# Altium schematic sheet E-25 Microphone.SchDoc: E-25 Microphone
size B; DrawnBy: Jeremie Boulianne; Organization: Synthiam Inc.; Address1: Unit 10, 6120 - 11 St. SE; Address2: Calgary, AB; Address3: T2H 2L7; Address4: Canada; Revision: 0
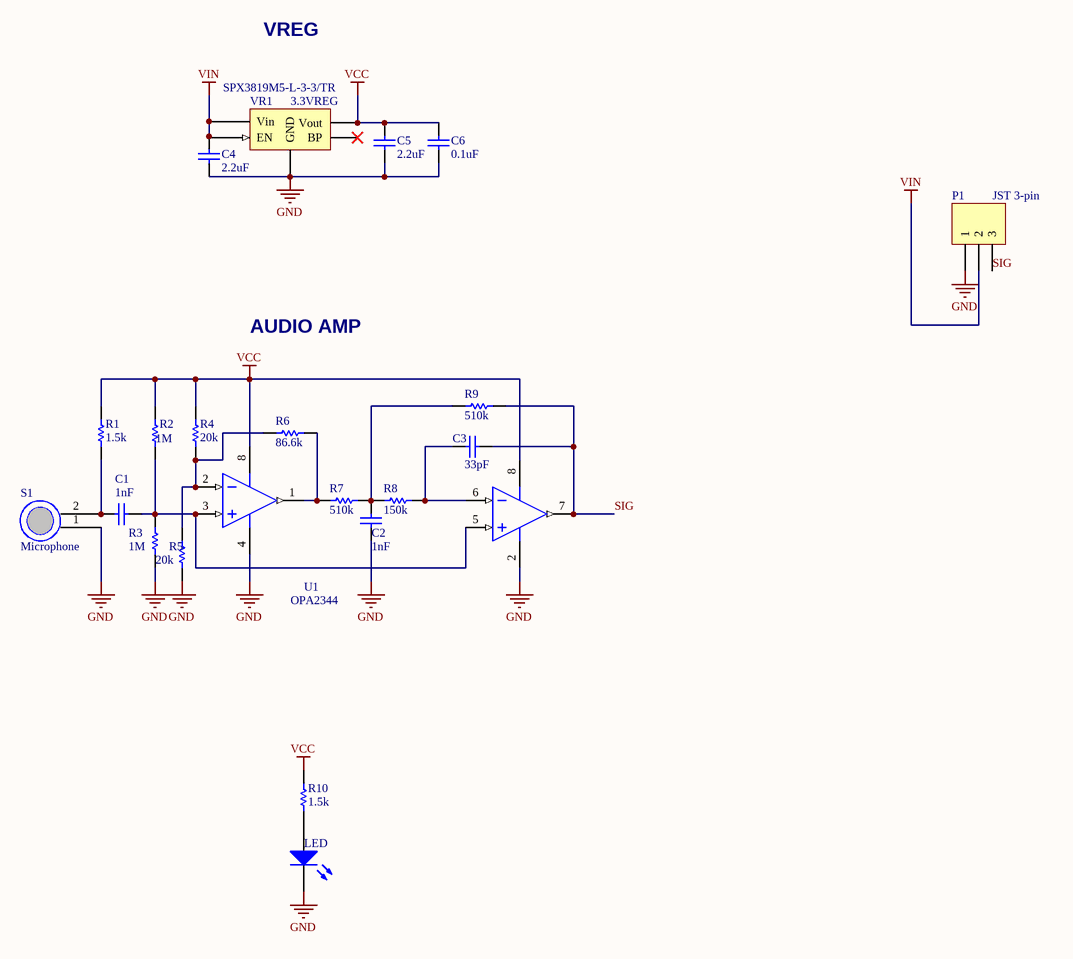
[diagram p0: E-25 Microphone.SchDoc]

## Parts
C1  value 1nF  [0603 TIGHT]  (hidden comment: 18pF)
C2  1nF  [0603 TIGHT]
C3  value 33pF  [0603 TIGHT]  (hidden comment: 18pF)
C4  2.2uF  [0603 TIGHT]
C5  value 2.2uF  [0603 TIGHT]  (hidden comment: 100nF)
C6  value 0.1uF  [0603 TIGHT]  (hidden comment: 100nF)
LED  LED2  [0805 LED - TIGHT]  (value not drawn)
P1  JST 3-pin  [JST-PH 3-pin SMD]
R1  value 1.5k  [0603 TIGHT]  (hidden comment: Res1)
R2  value 1M  [0603 TIGHT]  (hidden comment: Res1)
R3  value 1M  [0603 TIGHT]  (hidden comment: Res1)
R4  value 20k  [0603 TIGHT]  (hidden comment: Res1)
R5  value 20k  [0603 TIGHT]  (hidden comment: Res1)
R6  value 86.6k  [0603 TIGHT]  (hidden comment: Res1)
R7  value 510k  [0603 TIGHT]  (hidden comment: Res1)
R8  value 150k  [0603 TIGHT]  (hidden comment: Res1)
R9  value 510k  [0603 TIGHT]  (hidden comment: Res1)
R10  value 1.5k  [0603 TIGHT]  (hidden comment: Res1)
S1  Microphone  [MICROPHONE]
U1  OPA2344  [SO-8]
VR1  3.3VREG  [SOT-25 New]

## Nets
GND: C2.1 C4.2 C5.2 C6.2 LED.2(K) P1.1 R3.1 R5.1 S1.1 U1.2 U1.4(V-) VR1.3(GND)
VCC: C5.1 C6.1 R1.2 R2.2 R4.2 R10.2 U1.8(V+) VR1.2(Vout)
VIN: C4.1 P1.2 VR1.4(EN) VR1.5(Vin)
SIG: C3.1 P1.3 R9.1 U1.7(OUTB)
NetC1_1: C1.1 R2.1 R3.2 U1.3(INA+) U1.5(INB+)
NetC1_2: C1.2 R1.1 S1.2
NetC2_2: C2.2 R7.1 R8.2 R9.2
NetC3_2: C3.2 R8.1 U1.6(INB-)
NetLED_1: LED.1(A) R10.1
NetR4_1: R4.1 R5.2 R6.2 U1.2(INA-)
NetR6_1: R6.1 R7.2 U1.1(OUTA)

Not connected (* = marked no-connect by the designer): VR1 1(BP)*

## Notes on the sheet
- VREG
- AUDIO AMP
- Labels drawn without touching a wire or pin: SPX3819M5-L-3-3/TR
- Property of:
- Size:
- Date:
- B
- Drawn By:
- Time:
- Revision:
- Copyright © 2019 Synthiam Inc. All rights reserved.

## Library data of the parts
C1-C6 = Cap: Capacitor; Published: 8-Jun-2000; LatestRevisionDate: 17-Jul-2002; LatestRevisionNote: Re-released for DXP Platform.; PackageReference: RAD-0.3; Publisher: Altium Limited
  C2: Value: 1nF
  C4: Value: 2.2uF
LED = LED1: Typical RED GaAs LED; Published: 8-Jun-2000; LatestRevisionDate: 08-Jul-2005; LatestRevisionNote: Mech Layer 1 removed.; PackageReference: LED-1; Publisher: Altium Limited
P1 = Header 3: Header, 3-Pin; LatestRevisionDate: 17-Jul-2002; LatestRevisionNote: Re-released for DXP Platform.; Publisher: Altium Limited
R1-R10 = Res1: Resistor; Published: 8-Jun-2000; LatestRevisionDate: 17-Jul-2002; LatestRevisionNote: Re-released for DXP Platform.; PackageReference: AXIAL-0.3; Publisher: Altium Limited
S1 = MIC
U1 = OPA2345
VR1 = Vreg SOT25